# Altium schematic sheet KIT-ESP32.SchDoc
size A; SheetNumber: 1; SheetTotal: 3
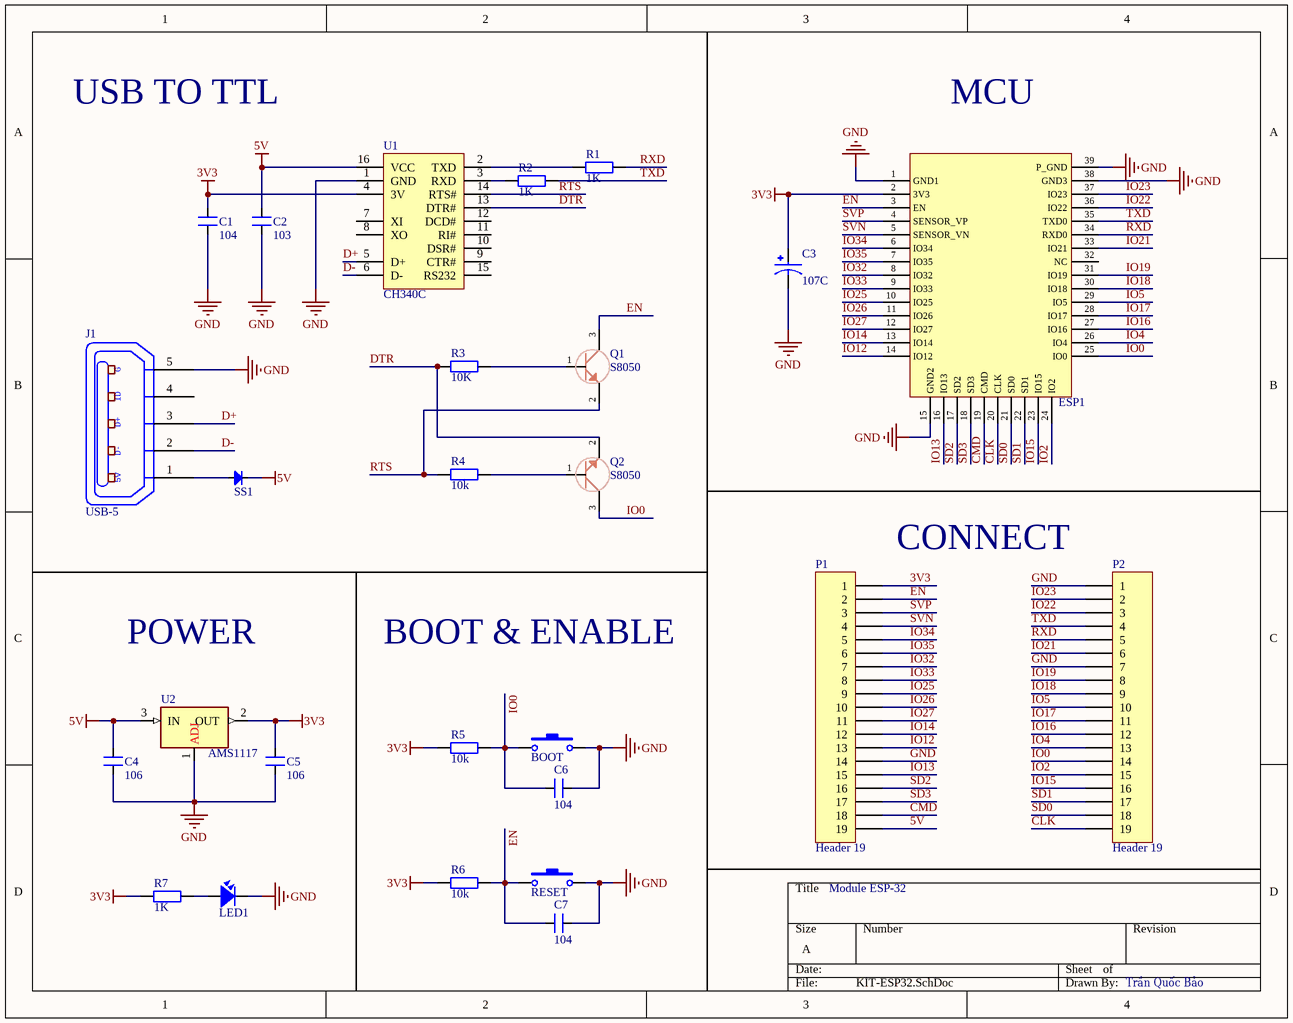
[diagram p0: KIT-ESP32.SchDoc]

## Parts
BOOT  SW-SMD  [SW-SMD]  (value not drawn)
C1  104  [SM-0805]
C2  103  [SM-0805]
C3  107C  [CAP_TANTALUM_3528]
C4  106  [SM-0805]
C5  106  [SM-0805]
C6  104  [SM-0805]
C7  104  [SM-0805]
ESP1  ESP32  [ESP_WROOM_32]  (value not drawn)
J1  USB-5  [USB-M1]
LED1  LED  [LED 3512]  (value not drawn)
P1  Header 19  [HDR1X19]
P2  Header 19  [HDR1X19]
Q1  S8050  [SOT23]
Q2  S8050  [SOT23]
R1  value 1K  [DIEN TRO 0805]  (hidden comment: R0805)
R2  value 1K  [DIEN TRO 0805]  (hidden comment: R0805)
R3  value 10K  [DIEN TRO 0805]  (hidden comment: R0805)
R4  value 10k  [DIEN TRO 0805]  (hidden comment: R0805)
R5  value 10k  [DIEN TRO 0805]  (hidden comment: R0805)
R6  value 10k  [DIEN TRO 0805]  (hidden comment: R0805)
R7  value 1K  [DIEN TRO 0805]  (hidden comment: R0805)
RESET  SW-SMD  [SW-SMD]  (value not drawn)
SS1  Diode SMD  [DIO-SMD-106]  (value not drawn)
U1  CH340C  [SO16]
U2  AMS1117  [SOT223-4N]

## Nets
3V3: C1.2 C3.1 C5.2 ESP1.2(3V3) P1.1 R5.1 R6.1 R7.1 U1.4(3V) U2.2(OUT)
5V: C2.2 C4.2 P1.19 SS1.2(K) U1.16(VCC) U2.3(IN)
GND: BOOT.2 C1.1 C2.1 C3.2 C4.1 C5.1 C6.1 C7.1 ESP1.1(GND1) ESP1.15(GND2) ESP1.38(GND3) ESP1.39(P_GND) J1.5(P5) LED1.2 P1.14 P2.1 P2.7 RESET.2 U1.1(GND) U2.1(ADJ)
CLK: ESP1.20(CLK) P2.19
CMD: ESP1.19(CMD) P1.18
D+: J1.3(P3) U1.5(D+)
D-: J1.2(P2) U1.6(D-)
DTR: Q2.2(E) R3.1 U1.13(DTR#)
EN: C7.2 ESP1.3(EN) P1.2 Q1.3(C) R6.2 RESET.1
IO0: BOOT.1 C6.2 ESP1.25(IO0) P2.14 Q2.3(C) R5.2
IO2: ESP1.24(IO2) P2.15
IO4: ESP1.26(IO4) P2.13
IO5: ESP1.29(IO5) P2.10
IO12: ESP1.14(IO12) P1.13
IO13: ESP1.16(IO13) P1.15
IO14: ESP1.13(IO14) P1.12
IO15: ESP1.23(IO15) P2.16
IO16: ESP1.27(IO16) P2.12
IO17: ESP1.28(IO17) P2.11
IO18: ESP1.30(IO18) P2.9
IO19: ESP1.31(IO19) P2.8
IO21: ESP1.33(IO21) P2.6
IO22: ESP1.36(IO22) P2.3
IO23: ESP1.37(IO23) P2.2
IO25: ESP1.10(IO25) P1.9
IO26: ESP1.11(IO26) P1.10
IO27: ESP1.12(IO27) P1.11
IO32: ESP1.8(IO32) P1.7
IO33: ESP1.9(IO33) P1.8
IO34: ESP1.6(IO34) P1.5
IO35: ESP1.7(IO35) P1.6
RTS: Q1.2(E) R4.1 U1.14(RTS#)
RXD: ESP1.34(RXD0) P2.5 R1.2
SD0: ESP1.21(SD0) P2.18
SD1: ESP1.22(SD1) P2.17
SD2: ESP1.17(SD2) P1.16
SD3: ESP1.18(SD3) P1.17
SVN: ESP1.5(SENSOR_VN) P1.4
SVP: ESP1.4(SENSOR_VP) P1.3
TXD: ESP1.35(TXD0) P2.4 R2.2
NetJ1_1: J1.1(P1) SS1.1(A)
NetLED1_1: LED1.1 R7.2
NetQ1_1: Q1.1(B) R3.2
NetQ2_1: Q2.1(B) R4.2
NetR1_1: R1.1 U1.2(TXD)
NetR2_1: R2.1 U1.3(RXD)

Not connected (* = marked no-connect by the designer): ESP1 32(NC); J1 4(P4); U1 7(XI) 8(XO) 9(CTR#) 10(DSR#) 11(RI#) 12(DCD#) 15(RS232)

## Notes on the sheet
- USB TO TTL
- MCU
- (near P1) CONNECT
- POWER
- BOOT & ENABLE
- Module ESP-32
- Trần Quốc Bảo
- (in symbol USB-5) G; ID; D+; D-; 5V

## Library data of the parts
BOOT RESET = SW-SMD: Switch; Published: 24-Mar-1999; LatestRevisionDate: 17-Jul-2002; LatestRevisionNote: Re-released for DXP Platform.; PackageReference: SPST-2; Publisher: Altium Limited
C1 C4-C7 = CM: Cap SMD; Value: 103
C2 = CM: Cap SMD; Value: 103
C3 = CAP_TANTALUM_SMD: Capacitor, Tantalum; MF: AVX; MP: TAJB475K025RNJ; SnapEDA_Link: https://www.snapeda.com/parts/TAJB475K025RNJ/AVX/view-part/?ref=snap; Package: 1411 AVX Corporation; Value: *; Check_prices: https://www.snapeda.com/parts/TAJB475K025RNJ/AVX/view-part/?ref=eda
ESP1 = ESP-WROOM-32
J1 = USB-5: Manufacturer: FCI; Manufacturer Part Number: 10118193-0001LF; Connector Type: USB - micro B; Number of Contacts: 5; Gender: Receptacle; Specifications: USB 2.0; .Creator: MM; .Checked PCB: RF; Supplier 1: Digi-Key; RoHS: RoHS Compliant; Category: Connectors, Interconnects; Stock 1: 28642; Pricing 1: 1=0.46, 10=0.433, 25=0.3712, 50=0.3156, 100=0.3032, 250=0.27224, 500=0.25988 (USD); Packaging: Cut Tape (CT); Mounting Type: Surface Mount, Right Angle, Horizontal; Features: Shielded, Solder Retention; Ingress Protection: -; ComponentLink1URL: http://portal.fciconnect.com/Comergent//fci/drawing/10118193.pdf; ComponentLink1Description: http://portal.fciconnect.com/Comergent//fci/drawing/10118193.pdf; Supplier Part Number 1: 609-4616-1-ND; .Checked SCH: MM
LED1 = LED SMD: Value: LED 3 - 5 ly 2 Colour
P1 P2 = Header 19: Header, 19-Pin; LatestRevisionDate: 17-Jul-2002; LatestRevisionNote: Re-released for DXP Platform.; Publisher: Altium Limited
Q1 Q2 = Transitor SMD
R1-R7 = R0805: Resistor SMD 0805; Published: 8-Jun-2000; LatestRevisionDate: 17-Jul-2002; LatestRevisionNote: Re-released for DXP Platform.; PackageReference: AXIAL-0.4; Publisher: Altium Limited
SS1 = Diode SMD: Default Diode; Code - JEDEC: DO-214-AB; Value: 1N5007; Published: 8-Jun-2000; Revision: July-2002: Re-released for DXP Platform.; Publisher: Altium Limited
U1 = CH340G: High and Low Side Driver; Note: Pins 4, 8 and 14 are not connected; Published: 8-Jun-2000; LatestRevisionDate: 04-Mar-2005; LatestRevisionNote: Stylized 3D Model Added.; DatasheetVersion: PD60147J; PackageReference: PDIP14; Publisher: Altium Limited; PackageDescription: DIP; 14 Leads; Row Spacing 7.62 mm; Pitch 2.54 mm; ComponentLink1Description: Manufacturer Link; ComponentLink1URL: http://www.irf.com/; ComponentLink2Description: Datasheet; ComponentLink2URL: http://www.irf.com/product-info/datasheets/data/ir2110.pdf
U2 = AMS1117: IC